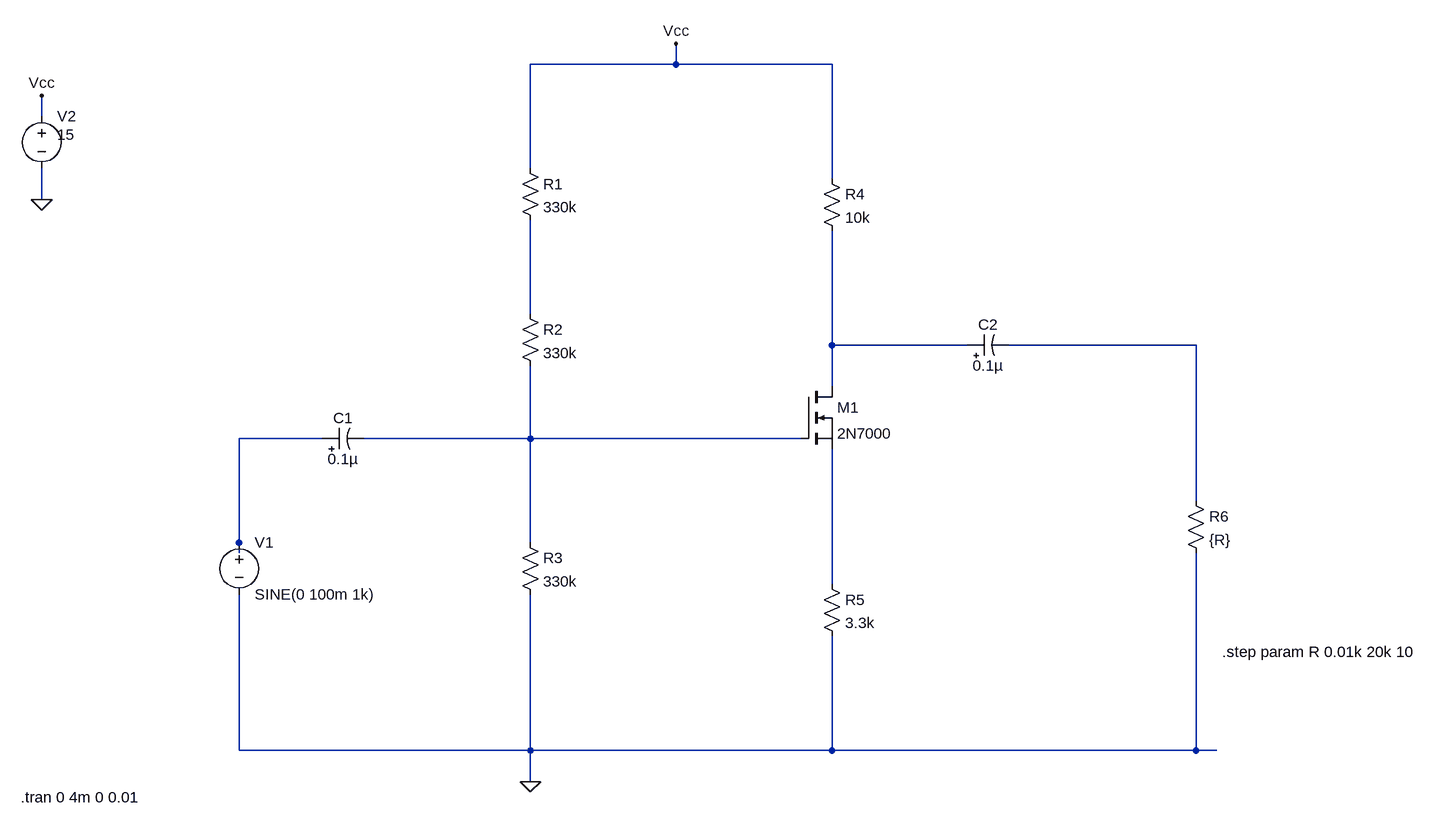
[diagram p0: schematic moschar_04_02_02_mosamp_rout.asc]
moschar_04_02_02_mosamp_rout.asc, the LTspice schematic file:
Version 4
SHEET 1 5032 1768
WIRE 3392 240 3392 208
WIRE 3392 240 3168 240
WIRE 3632 240 3392 240
WIRE 2416 320 2416 288
WIRE 3168 400 3168 240
WIRE 3632 416 3632 240
WIRE 2416 448 2416 400
WIRE 3168 624 3168 480
WIRE 3632 672 3632 496
WIRE 3840 672 3632 672
WIRE 4192 672 3904 672
WIRE 3632 736 3632 672
WIRE 2848 816 2720 816
WIRE 3168 816 3168 704
WIRE 3168 816 2912 816
WIRE 3584 816 3168 816
WIRE 4192 912 4192 672
WIRE 2720 976 2720 816
WIRE 3168 976 3168 816
WIRE 2720 992 2720 976
WIRE 3632 1040 3632 832
WIRE 2720 1296 2720 1056
WIRE 3168 1296 3168 1056
WIRE 3168 1296 2720 1296
WIRE 3632 1296 3632 1120
WIRE 3632 1296 3168 1296
WIRE 4192 1296 4192 992
WIRE 4192 1296 3632 1296
WIRE 4224 1296 4192 1296
WIRE 3168 1344 3168 1296
FLAG 3168 1344 0
FLAG 2416 448 0
FLAG 2416 288 Vcc
FLAG 3392 208 Vcc
SYMBOL nmos 3584 736 R0
SYMATTR InstName M1
SYMATTR Value 2N7000
SYMBOL res 3152 384 R0
SYMATTR InstName R1
SYMATTR Value 330k
SYMBOL res 3152 608 R0
SYMATTR InstName R2
SYMATTR Value 330k
SYMBOL res 3152 960 R0
SYMATTR InstName R3
SYMATTR Value 330k
SYMBOL res 3616 400 R0
SYMATTR InstName R4
SYMATTR Value 10k
SYMBOL res 3616 1024 R0
SYMATTR InstName R5
SYMATTR Value 3.3k
SYMBOL polcap 2848 832 R270
WINDOW 0 32 32 VTop 2
WINDOW 3 0 32 VBottom 2
SYMATTR InstName C1
SYMATTR Value 0.1µ
SYMBOL voltage 2720 960 R0
WINDOW 123 0 0 Left 2
WINDOW 39 0 0 Left 2
SYMATTR InstName V1
SYMATTR Value SINE(0 100m 1k)
SYMBOL voltage 2416 304 R0
WINDOW 3 24 44 Left 2
WINDOW 123 0 0 Left 2
WINDOW 39 0 0 Left 2
SYMATTR Value 15
SYMATTR InstName V2
SYMBOL polcap 3840 688 R270
WINDOW 0 32 32 VTop 2
WINDOW 3 0 32 VBottom 2
SYMATTR InstName C2
SYMATTR Value 0.1µ
SYMBOL res 4176 896 R0
SYMATTR InstName R6
SYMATTR Value {R}
TEXT 2384 1368 Left 2 !.tran 0 4m 0 0.01
TEXT 4232 1144 Left 2 !.step param R 0.01k 20k 10

The netlist it stands for:
* moschar_04_02_02_mosamp_rout.asc
M1 N002 N005 N006 N006 2N7000
R1 Vcc N001 330k
R2 N001 N005 330k
R3 N005 0 330k
R4 Vcc N002 10k
R5 N006 0 3.3k
C1 N004 N005 0.1µ
V1 N004 0 SINE(0 100m 1k)
V2 Vcc 0 15
C2 N002 N003 0.1µ
R6 N003 0 {R}
.model NMOS NMOS
.model PMOS PMOS
.lib standard.mos
.tran 0 4m 0 0.01
.step param R 0.01k 20k 10
.backanno
.end